# Altium schematic sheet ESP32S3.SchDoc
size A4; SheetNumber: 3; SheetTotal: 4
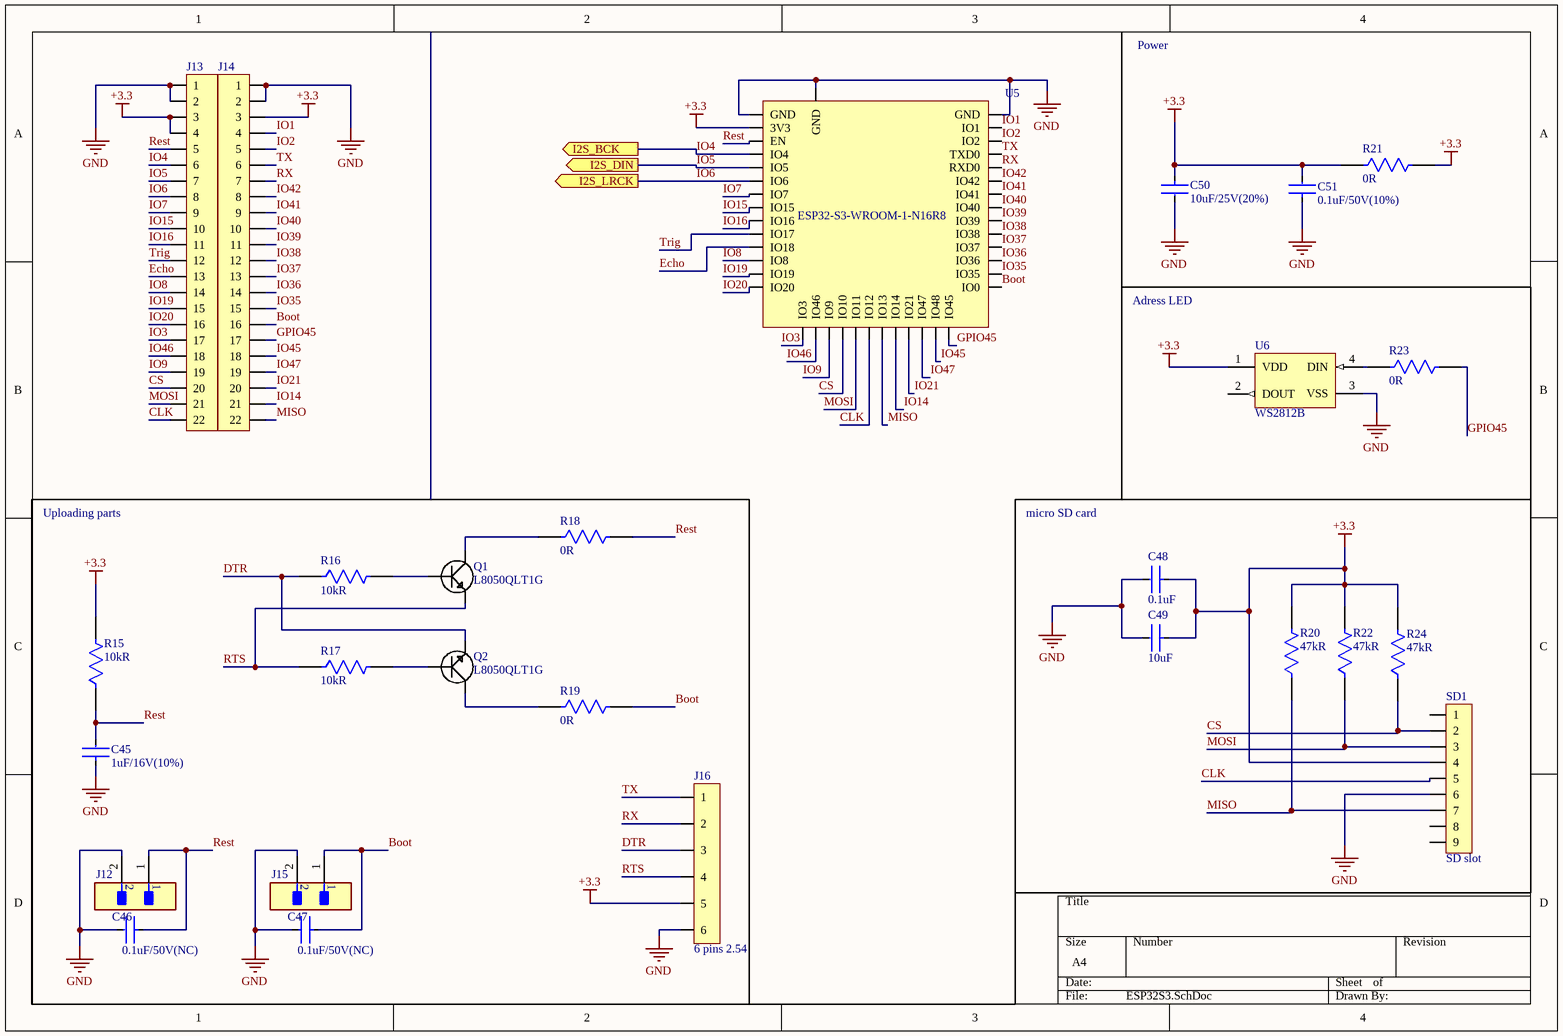
[diagram p0: ESP32S3.SchDoc]

## Parts
C45  1uF/16V(10%)  [FP-CL21-IPC_C]
C46  0.1uF/50V(NC)  [FP-CL21-IPC_C]
C47  0.1uF/50V(NC)  [FP-CL21-IPC_C]
C48  0.1uF  [FP-CL21-IPC_C]
C49  10uF  [FP-CL21-IPC_C]
C50  10uF/25V(20%)  [FP-CL21-IPC_C]
C51  0.1uF/50V(10%)  [FP-CL21-IPC_C]
J12  M22-2510205  [FP-M22-2510205-MFG]  (value not drawn)
J13  22 pins  [22 pins]  (value not drawn)
J14  22 pins  [22 pins]  (value not drawn)
J15  M22-2510205  [FP-M22-2510205-MFG]  (value not drawn)
J16  6 pins 2.54  [6 pins 2.54mm]
Q1  L8050QLT1G  [SOT95P245X110-3N]
Q2  L8050QLT1G  [SOT95P245X110-3N]
R15  10kR  [FP-RP732A-IPC_C]
R16  10kR  [FP-RP732A-IPC_C]
R17  10kR  [FP-RP732A-IPC_C]
R18  0R  [FP-RP732A-IPC_C]
R19  0R  [FP-RP732A-IPC_C]
R20  47kR  [FP-RP732A-IPC_C]
R21  0R  [FP-RP732A-IPC_C]
R22  47kR  [FP-RP732A-IPC_C]
R23  0R  [FP-RP732A-IPC_C]
R24  47kR  [FP-RP732A-IPC_C]
SD1  SD slot  [Micro SD slot]
U5  ESP32-S3-WROOM-1-N16R8  [ESP32_S3_Wroom1]
U6  WS2812B  [ADA-RGB-1655_V]

## Blocks framed on the sheet
Uploading parts: C45-C47 J12 J15 J16 Q1 Q2 R15-R19
micro SD card: C48 C49 R20 R22 R24 SD1

## Ports
I2S_BCK (out, see PCM5102[1B]), I2S_DIN (out, see PCM5102[1B]), I2S_LRCK (out, see PCM5102[1B])

## Nets
+3.3: C48.1 C49.1 C50.1 C51.2 J13.3 J13.4 J14.3 J16.5 R15.2 R20.2 R21.1 R21.2 R22.2 R24.2 SD1.4 U5.2(3V3) U6.1(VDD)
GND: C45.1 C46.2 C47.2 C48.2 C49.2 C50.2 C51.1 J12.2 J13.1 J13.2 J14.1 J14.2 J15.2 J16.6 SD1.6 U5.1(GND) U5.40(GND) U5.41(GND) U6.3(VSS)
Boot: C47.1 J14.16 J15.1 R19.2 U5.27(IO0)
CLK: J13.22 SD1.5 U5.20(IO12)
CS: J13.20 R24.1 SD1.2 U5.18(IO10)
DTR: J16.3 Q2.2(Emitter) R16.1
Echo: J13.13 U5.11(IO18)
GPIO45: J14.17 R23.2 U5.26(IO45)
IO1: J14.4 U5.39(IO1)
IO2: J14.5 U5.38(IO2)
IO3: J13.17 U5.15(IO3)
IO4: J13.6 U5.4(IO4) ; port I2S_BCK
IO5: J13.7 U5.5(IO5) ; port I2S_DIN
IO6: J13.8 U5.6(IO6) ; port I2S_LRCK
IO7: J13.9 U5.7(IO7)
IO8: J13.14 U5.12(IO8)
IO9: J13.19 U5.17(IO9)
IO14: J14.21 U5.22(IO14)
IO15: J13.10 U5.8(IO15)
IO16: J13.11 U5.9(IO16)
IO19: J13.15 U5.13(IO19)
IO20: J13.16 U5.14(IO20)
IO21: J14.20 U5.23(IO21)
IO35: J14.15 U5.28(IO35)
IO36: J14.14 U5.29(IO36)
IO37: J14.13 U5.30(IO37)
IO38: J14.12 U5.31(IO38)
IO39: J14.11 U5.32(IO39)
IO40: J14.10 U5.33(IO40)
IO41: J14.9 U5.34(IO41)
IO42: J14.8 U5.35(IO42)
IO45: J14.18 U5.25(IO48)
IO46: J13.18 U5.16(IO46)
IO47: J14.19 U5.24(IO47)
MISO: J14.22 R20.1 SD1.7 U5.21(IO13)
MOSI: J13.21 R22.1 SD1.3 U5.19(IO11)
Rest: C45.2 C46.1 J12.1 J13.5 R15.1 R18.2 U5.3(EN)
RTS: J16.4 Q1.2(Emitter) R17.1
RX: J14.7 J16.2 U5.36(RXD0)
Trig: J13.12 U5.10(IO17)
TX: J14.6 J16.1 U5.37(TXD0)
NetQ1_1: Q1.1(Base) R16.2
NetQ1_3: Q1.3(Collector) R18.1
NetQ2_1: Q2.1(Base) R17.2
NetQ2_3: Q2.3(Collector) R19.1
NetR23_1: R23.1 U6.4(DIN)

Not connected (* = marked no-connect by the designer): SD1 1 8 9; U6 2(DOUT)

## Notes on the sheet
- Power
- Adress LED

## Library data of the parts
C45 = CMP-13271-002689-1: CL21 Series 0805 47nF 50V ±5% Tolerance X7R Multilayer Ceramic Chip Capacitor; Voltage Rating (DC): 16V; Capacitance: 1uF; Package Quantity: 10000; Height: 0.85mm; Max Operating Temperature: 125°C; Dielectric: X7R; Radiation Hardening: No; Mount: Surface Mount; Voltage Rating: 50V; Tolerance: 5%; Depth: 1.25mm; Min Operating Temperature: -55°C; Width: 0.049inch; Case/Package: 0805; Length: 2mm; Packaging: Tape and Reel; Thickness: 0.037inch
C46 C47 C51 = CMP-13271-002689-1: CL21 Series 0805 47nF 50V ±5% Tolerance X7R Multilayer Ceramic Chip Capacitor; Capacitance: 0.1uF; Voltage Rating (DC): 50V; Package Quantity: 10000; Height: 0.85mm; Max Operating Temperature: 125°C; Dielectric: X7R; Radiation Hardening: No; Mount: Surface Mount; Voltage Rating: 50V; Tolerance: 5%; Depth: 1.25mm; Min Operating Temperature: -55°C; Width: 0.049inch; Case/Package: 0805; Length: 2mm; Packaging: Tape and Reel; Thickness: 0.037inch
C48 C49 = CMP-13271-002689-1: CL21 Series 0805 47nF 50V ±5% Tolerance X7R Multilayer Ceramic Chip Capacitor; Voltage Rating (DC): 50V; Package Quantity: 10000; Height: 0.85mm; Max Operating Temperature: 125°C; Dielectric: X7R; Radiation Hardening: No; Mount: Surface Mount; Voltage Rating: 50V; Tolerance: 5%; Depth: 1.25mm; Min Operating Temperature: -55°C; Width: 0.049inch; Case/Package: 0805; Length: 2mm; Packaging: Tape and Reel; Thickness: 0.037inch
  C48: Capacitance: 0.1uF
  C49: Capacitance: 10uF
C50 = CMP-13271-002689-1: CL21 Series 0805 47nF 50V ±5% Tolerance X7R Multilayer Ceramic Chip Capacitor; Voltage Rating (DC): 25V; Capacitance: 10uF; Package Quantity: 10000; Height: 0.85mm; Max Operating Temperature: 125°C; Dielectric: X7R; Radiation Hardening: No; Mount: Surface Mount; Voltage Rating: 50V; Tolerance: 5%; Depth: 1.25mm; Min Operating Temperature: -55°C; Width: 0.049inch; Case/Package: 0805; Length: 2mm; Packaging: Tape and Reel; Thickness: 0.037inch
J12 J15 = CMP-15831-000005-1: CONN HEADER VERT 2POS 2MM; Manufacturer: Harwin; Conn Gender: Male; Current Rating: 2A; Number Of Contacts: 2; Conn Orientation: Vertical; Temperature Range Low: -40°C; Device Class L1: Connectors; ComponentLink2URL: https://cdn.harwin.com/pdfs/C018XX_M22_Series_Connectors.pdf; Temperature Range High: +105°C; Pitch: 2mm; Number Of Rows: 1; Temperature: -40°C to +105°C; Automotive: No; Device Class L3: unset; Octopart: https://octopart.com/m22-2510205-harwin-2538221; Mouser Description: Headers & Wire Housings 2 PIN SIL VERTICAL GOLD PIN HEADER; Height: 5.45mm; Category: Conn; Digikey Description: CONN HEADER VERT 2POS 2MM; Contact Material: Gold,Nickel; Lead Free: Yes; ComponentLink2Description: Datasheet; Manufacturer Part Number: M22-2510205; Device Class L2: Headers and Wire Housings; Package: 0; Footprint Url: https://cdn.harwin.com/pdfs/M22-251.pdf; RoHS: TRUE
R15-R24 = CMP-03211-008429-2: Surface Mount Resistors, Precision Resistor, 2 Terminations, Size Code 0805, Cut Tape Length, .1%, Thin Film, 10K 0.1% 10PPM; Temperature Coefficient: 15ppm/°C; Number of Resistors: 1; Power Rating: 125mW; Voltage Rating (DC): 150V; REACH SVHC: No SVHC; Height: 0.55mm; Number of Pins: 2; ELV: Compliant; Termination: Solder; Number of Terminations: 2; Case Code (Imperial): 0805; Mount: Surface Mount; Case/Package: 0805; Case Code (Metric): 2012; Length: 2mm; Packaging: Cut Tape; Composition: Thin Film; Max Operating Temperature: 155°C; Tolerance: 0.1%; Min Operating Temperature: -55°C; Package Quantity: 250; Width: 1.25mm; Voltage Rating: 150V; Weight: 0.000194oz
  R15-R17: Resistance: 10kR
  R18 R19 R21 R23: Resistance: 0R
  R20 R22 R24: Resistance: 47kR
U5 = ESP32-S3-WROOM-1-N16R8: SMD mod, ESP32-S3R8 with 3.3V, 8MB Octal PSRAM die insid, 6MBQuad SPI flash, pcb ant; Manufacturer: Espressif Systems; Supplier: Mouser; Supplier Part Number: 356-ESP32S3WRM1N16R8; Manufacturer Part Number: ESP32-S3-WROOM-1-N16R8; RoHS: No; Category: LDO; Pricing: 1=6,71, 10=6,15, 50=5,6, 100=5,03, 1000=4,3, 10000=4,3 (USD); ComponentLink1URL: https://datasheet.octopart.com/ESP32-S3-WROOM-1-N16R8-Espressif-Systems-datasheet-188867343.pdf?src-supplier=TME; ComponentLink1Description: https://datasheet.octopart.com/ESP32-S3-WROOM-1-N16R8-Espressif-Systems-datasheet-188867343.pdf?src-supplier=TME
U6 = CMP-2000-05026-1: Intelligent Control LED Integrated Light Source, 3.5 to 5.3 V, -25 to 80 degC, 4-Pin SMD, RoHS, Tape and Reel; Manufacturer: Adafruit-Industries-LLC; Number of LEDs: 10; Configuration: Discrete; Utilized LED: WS2812(5050); Datasheet URL: http://datasheet.octopart.com/ADA1655-Adafruit-Industries-datasheet-32028139.pdf; Series: Neopixel; Interface: -; Package Description: 4-Pin Surface Mount Device, Body 5 x 5 mm; Color: Red,Green,Blue(RGB); Category: Optoelectronics; Controller Type: -; Package Reference: 1655; Manufacturer URL: https://www.adafruit.com/; Mounting Type: SurfaceMount; Datasheet Version: May-13; Size / Dimension: 5.00mmLx5.00mmW; Family: Addressable,Specialty